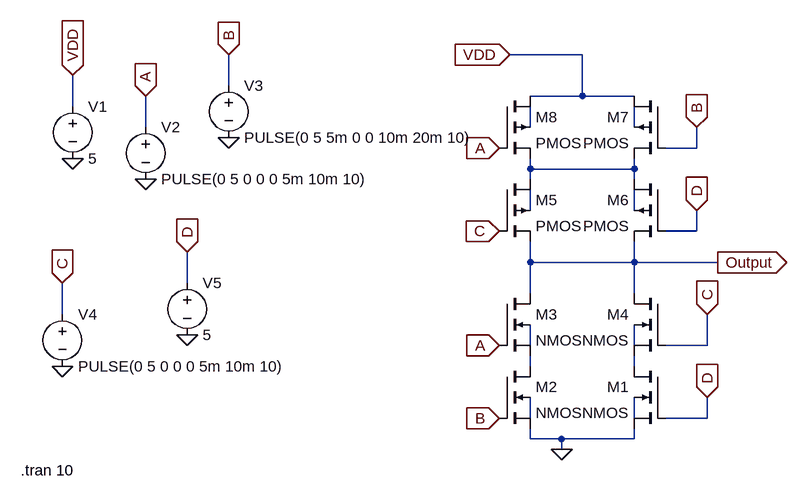
[diagram p0: schematic AOI22.asc]
AOI22.asc, the LTspice schematic file:
Version 4.1
SHEET 1 880 680
WIRE 224 -240 112 -240
WIRE -320 -192 -320 -240
WIRE 224 -176 224 -240
WIRE 224 -176 144 -176
WIRE 304 -176 224 -176
WIRE -560 -160 -560 -208
WIRE -448 -128 -448 -176
WIRE 144 -128 144 -160
WIRE 304 -128 304 -160
WIRE 400 -96 400 -128
WIRE 400 -96 352 -96
WIRE 144 -64 144 -80
WIRE 304 -64 304 -80
WIRE 304 -64 144 -64
WIRE 144 -48 144 -64
WIRE 304 -48 304 -64
WIRE 144 0 144 -32
WIRE 304 0 304 -32
WIRE 400 32 400 0
WIRE 400 32 352 32
WIRE 144 80 144 48
WIRE 304 80 304 48
WIRE 304 80 144 80
WIRE 432 80 304 80
WIRE -384 112 -384 64
WIRE 144 128 144 80
WIRE 304 128 304 80
WIRE -576 160 -576 112
WIRE 144 208 144 176
WIRE 304 208 304 176
WIRE 416 208 416 160
WIRE 416 208 352 208
WIRE 144 240 144 224
WIRE 304 240 304 224
WIRE 144 320 144 288
WIRE 304 320 304 288
WIRE 416 320 416 288
WIRE 416 320 352 320
WIRE 144 352 144 336
WIRE 192 352 144 352
WIRE 304 352 304 336
WIRE 304 352 192 352
WIRE 192 368 192 352
FLAG 192 368 0
FLAG 112 -240 VDD
IOPIN 112 -240 In
FLAG 96 208 A
IOPIN 96 208 In
FLAG 96 -96 A
IOPIN 96 -96 In
FLAG 96 320 B
IOPIN 96 320 In
FLAG 400 -128 B
IOPIN 400 -128 In
FLAG 432 80 Output
IOPIN 432 80 Out
FLAG 96 32 C
IOPIN 96 32 In
FLAG 416 160 C
IOPIN 416 160 In
FLAG 416 288 D
IOPIN 416 288 In
FLAG 400 0 D
IOPIN 400 0 In
FLAG -560 -208 VDD
IOPIN -560 -208 In
FLAG -448 -176 A
IOPIN -448 -176 In
FLAG -320 -240 B
IOPIN -320 -240 In
FLAG -576 112 C
IOPIN -576 112 In
FLAG -384 64 D
IOPIN -384 64 In
FLAG -560 -80 0
FLAG -448 -48 0
FLAG -320 -112 0
FLAG -576 240 0
FLAG -384 192 0
SYMBOL nmos4 352 240 M0
SYMATTR InstName M1
SYMBOL nmos4 96 240 R0
SYMATTR InstName M2
SYMBOL nmos4 96 128 R0
SYMATTR InstName M3
SYMBOL nmos4 352 128 M0
SYMATTR InstName M4
SYMBOL pmos4 96 -48 R0
SYMATTR InstName M5
SYMBOL pmos4 352 -48 M0
SYMATTR InstName M6
SYMBOL pmos4 352 -176 M0
SYMATTR InstName M7
SYMBOL pmos4 96 -176 R0
SYMATTR InstName M8
SYMBOL voltage -560 -176 R0
WINDOW 123 0 0 Left 0
WINDOW 39 0 0 Left 0
SYMATTR InstName V1
SYMATTR Value 5
SYMBOL voltage -448 -144 R0
WINDOW 123 0 0 Left 0
WINDOW 39 0 0 Left 0
SYMATTR InstName V2
SYMATTR Value PULSE(0 5 0 0 0 5m 10m 10)
SYMBOL voltage -320 -208 R0
WINDOW 123 0 0 Left 0
WINDOW 39 0 0 Left 0
SYMATTR InstName V3
SYMATTR Value PULSE(0 5 5m 0 0 10m 20m 10)
SYMBOL voltage -576 144 R0
WINDOW 123 0 0 Left 0
WINDOW 39 0 0 Left 0
SYMATTR InstName V4
SYMATTR Value PULSE(0 5 0 0 0 5m 10m 10)
SYMBOL voltage -384 96 R0
WINDOW 123 0 0 Left 0
WINDOW 39 0 0 Left 0
SYMATTR InstName V5
SYMATTR Value 5
TEXT -640 400 Left 2 !.tran 10

The netlist it stands for:
* AOI22.asc
M1 N009 D 0 N011 NMOS
M2 N008 B 0 N010 NMOS
M3 Output A N008 N006 NMOS
M4 Output C N009 N007 NMOS
M5 N003 C Output N004 PMOS
M6 N003 D Output N005 PMOS
M7 VDD B N003 N002 PMOS
M8 VDD A N003 N001 PMOS
V1 VDD 0 5
V2 A 0 PULSE(0 5 0 0 0 5m 10m 10)
V3 B 0 PULSE(0 5 5m 0 0 10m 20m 10)
V4 C 0 PULSE(0 5 0 0 0 5m 10m 10)
V5 D 0 5
.model NMOS NMOS
.model PMOS PMOS
.lib standard.mos
.tran 10
.backanno
.end